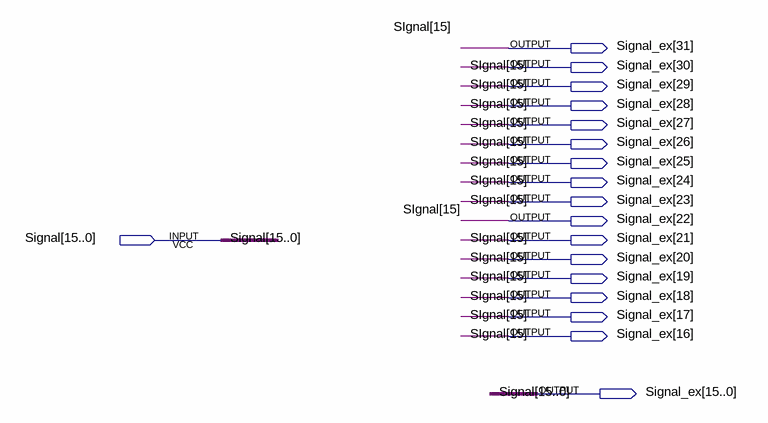
[diagram p0: schematic sheet]
// Quartus schematic sign_ex1.bdf as structural Verilog: 0 symbols, 18 pins
module sign_ex1 (
  input  [15:0] Signal,
  output [31:0] Signal_ex
);


  assign Signal_ex = {{17{Signal[15]}}, Signal[14:0]};
endmodule
